# Altium schematic sheet Power_Supply.SchDoc
size A3; SheetNumber: 1; SheetTotal: 1
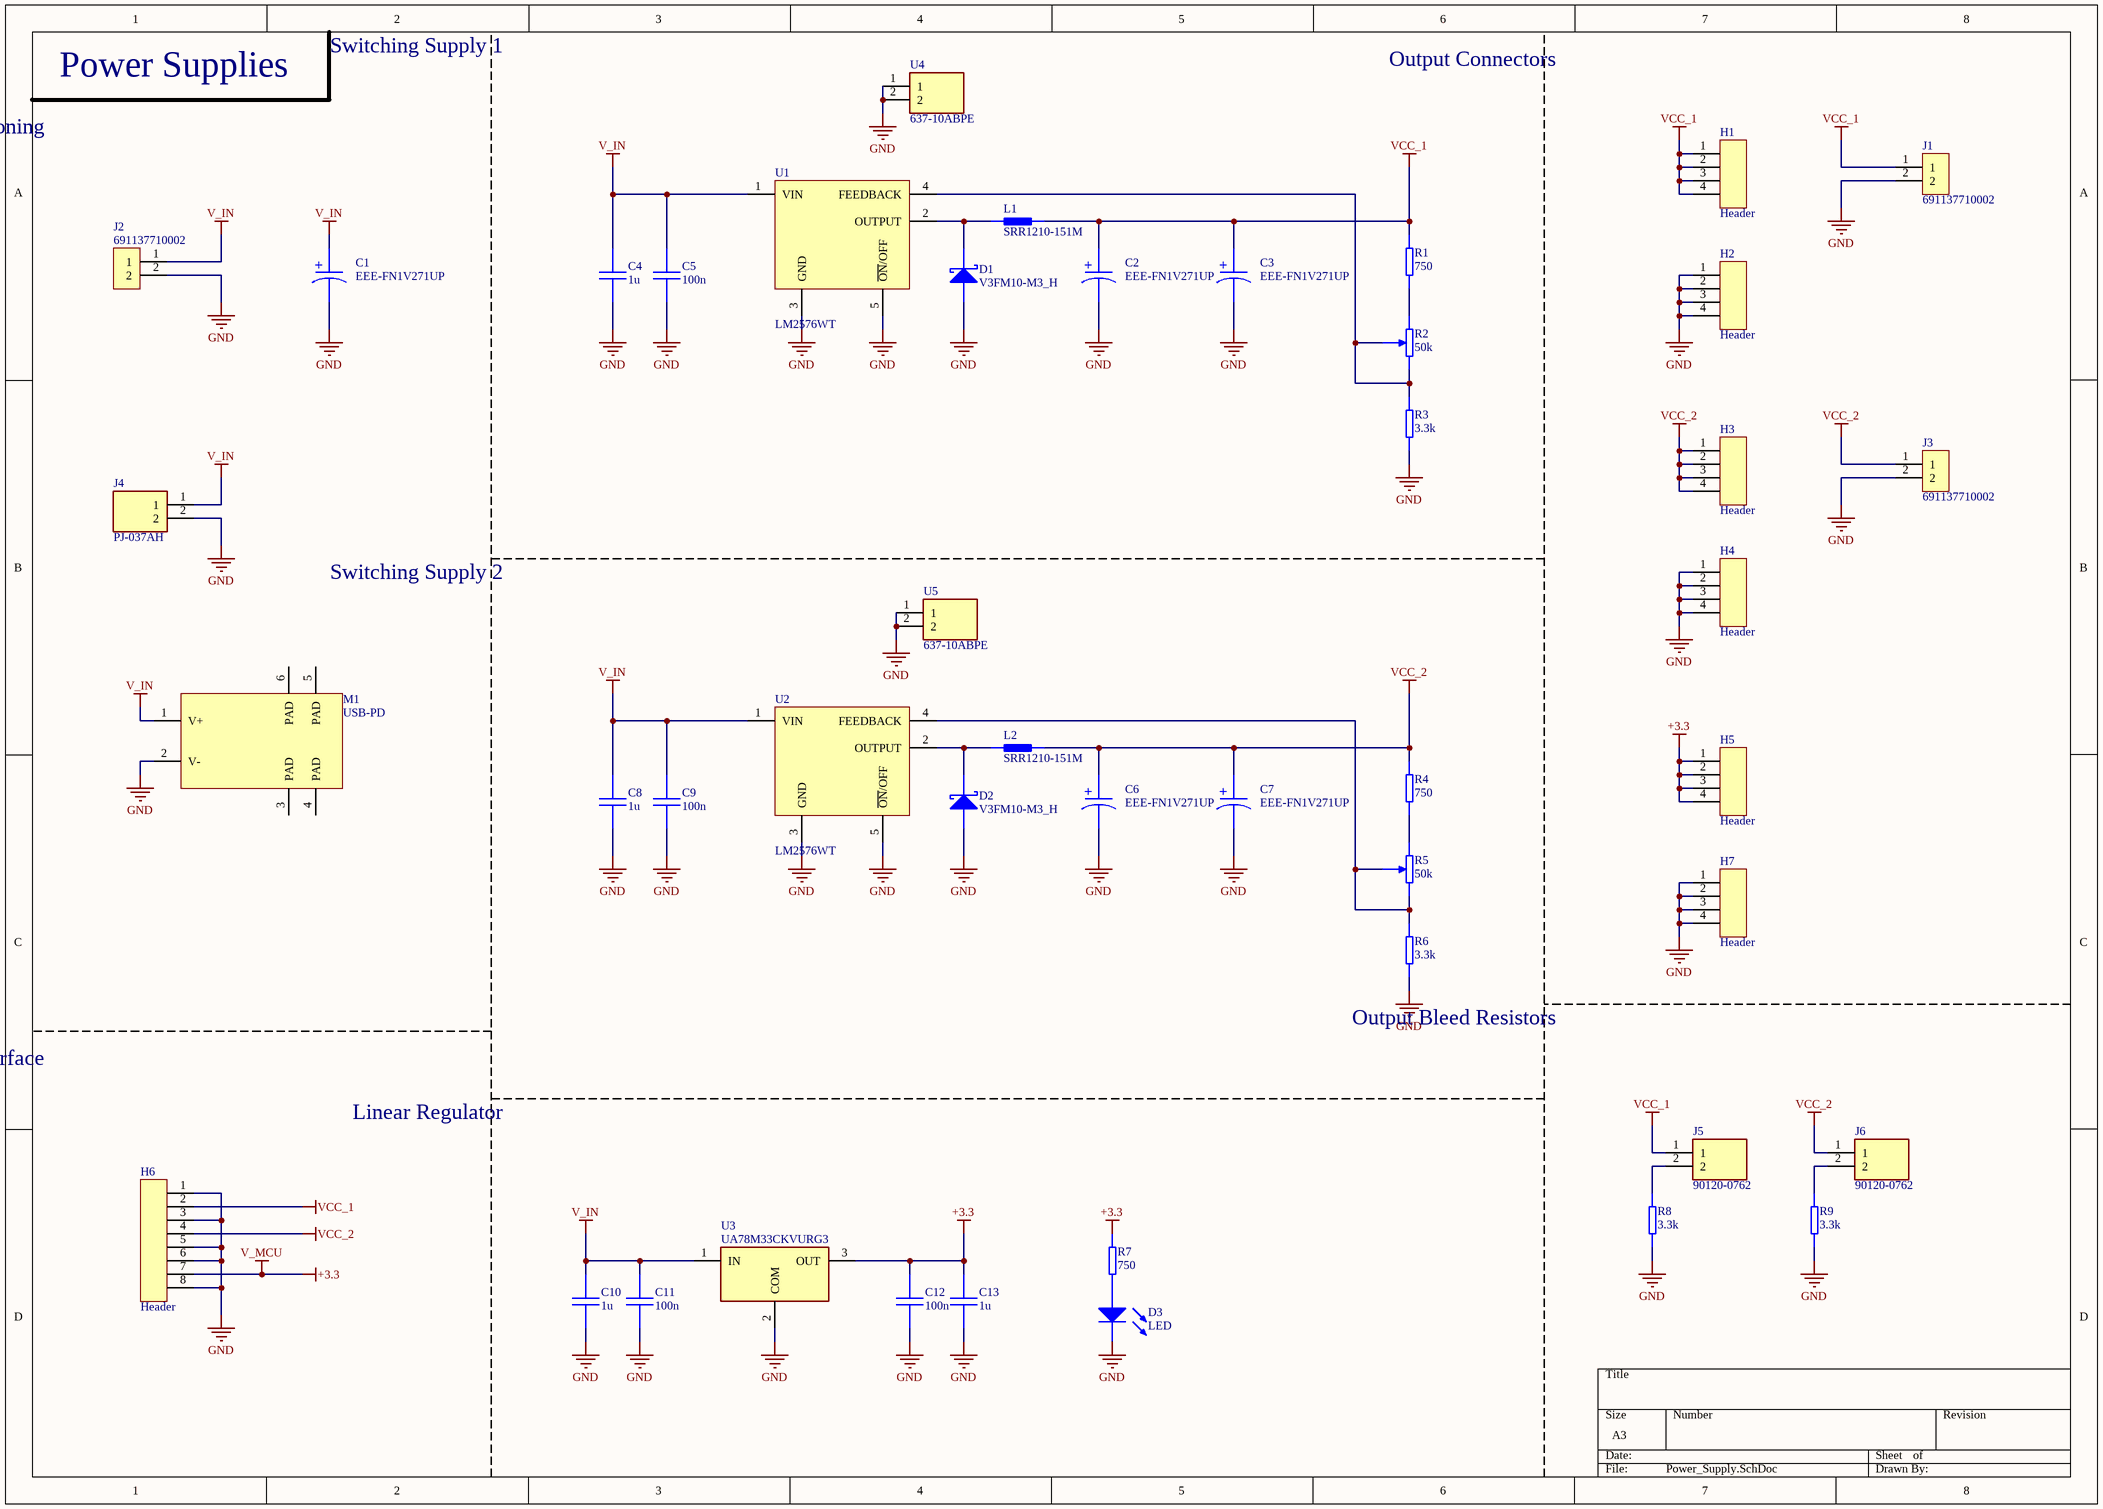
[diagram p0: Power_Supply.SchDoc]

## Parts
C1  EEE-FN1V271UP  [EEHZT1E331UP]
C2  EEE-FN1V271UP  [EEHZT1E331UP]
C3  EEE-FN1V271UP  [EEHZT1E331UP]
C4  1u  [CAP0805]
C5  100n  [CAP0805]
C6  EEE-FN1V271UP  [EEHZT1E331UP]
C7  EEE-FN1V271UP  [EEHZT1E331UP]
C8  1u  [CAP0805]
C9  100n  [CAP0805]
C10  1u  [CAP0805]
C11  100n  [CAP0805]
C12  100n  [CAP0805]
C13  1u  [CAP0805]
D1  V3FM10-M3_H  [DO-219AB]
D2  V3FM10-M3_H  [DO-219AB]
D3  LED  [LEDM2012X80N]
H1  Header  [Header_1X4]
H2  Header  [Header_1X4]
H3  Header  [Header_1X4]
H4  Header  [Header_1X4]
H5  Header  [Header_1X4]
H6  Header  [Header_1X8]
H7  Header  [Header_1X4]
J1  691137710002  [SHDR2W70P0X500_1X2_1000X750X1160P]
J2  691137710002  [SHDR2W70P0X500_1X2_1000X750X1160P]
J3  691137710002  [SHDR2W70P0X500_1X2_1000X750X1160P]
J4  PJ-037AH  [PJ037AH]
J5  90120-0762  [HDRV2W35P0X254_1X2_508X249X560P]
J6  90120-0762  [HDRV2W35P0X254_1X2_508X249X560P]
L1  SRR1210-151M  [INDPM120120X1000N-D]
L2  SRR1210-151M  [INDPM120120X1000N-D]
M1  USB-PD  [USB_C-PD]
R1  750  [RESC0805]
R2  50k  [3339P1103LF]
R3  3.3k  [RESC0805]
R4  750  [RESC0805]
R5  50k  [3339P1103LF]
R6  3.3k  [RESC0805]
R7  750  [RESC0805]
R8  3.3k  [RESC0805]
R9  3.3k  [RESC0805]
U1  LM2576WT  [TO-220-5]
U2  LM2576WT  [TO-220-5]
U3  UA78M33CKVURG3  [TO-252-3]
U4  637-10ABPE  [63710ABPE]
U5  637-10ABPE  [63710ABPE]

## Nets
+3.3: C12.1 C13.1 H5.1 H5.2 H5.3 H5.4 H6.7 R7.1 U3.3(OUT)  [also labelled V_MCU]
GND: C1.2 C2.2 C3.2 C4.2 C5.2 C6.2 C7.2 C8.2 C9.2 C10.2 C11.2 C12.2 C13.2 D1.2(A) D2.2(A) D3.1(K) H2.1 H2.2 H2.3 H2.4 H4.1 H4.2 H4.3 H4.4 H6.1 H6.3 H6.5 H6.6 H6.8 H7.1 H7.2 H7.3 H7.4 J1.2 J2.2 J3.2 J4.2 M1.2(V-) R3.2 R6.2 R8.2 R9.2 U1.3(GND) U1.5(~{ON}/OFF) U2.3(GND) U2.5(~{ON}/OFF) U3.2(COM) U4.1 U4.2 U5.1 U5.2
V_IN: C1.1 C4.1 C5.1 C8.1 C9.1 C10.1 C11.1 J2.1 J4.1 M1.1(V+) U1.1(VIN) U2.1(VIN) U3.1(IN)
VCC_1: C2.1 C3.1 H1.1 H1.2 H1.3 H1.4 H6.2 J1.1 J5.1 L1.2 R1.1
VCC_2: C6.1 C7.1 H3.1 H3.2 H3.3 H3.4 H6.4 J3.1 J6.1 L2.2 R4.1
NetD1_1: D1.1(K) L1.1 U1.2(OUTPUT)
NetD2_1: D2.1(K) L2.1 U2.2(OUTPUT)
NetD3_2: D3.2(A) R7.2
NetJ5_2: J5.2 R8.1
NetJ6_2: J6.2 R9.1
NetR1_2: R1.2 R2.1
NetR2_2: R2.2 R2.3 R3.1 U1.4(FEEDBACK)
NetR4_2: R4.2 R5.1
NetR5_2: R5.2 R5.3 R6.1 U2.4(FEEDBACK)

Not connected (* = marked no-connect by the designer): M1 3(PAD) 4(PAD) 5(PAD) 6(PAD)

## Notes on the sheet
- Power Supplies
- Switching Supply 1
- Output Connectors
- Input Connectors and Conditioning
- Switching Supply 2
- Output Bleed Resistors
- Power Interface
- Linear Regulator
- (in symbol EEE-FN1V271UP) +

## Library data of the parts
C1-C3 C6 C7 = EEE-FN1V271UP: Capacitor Polarised; Manufacturer_Name: Panasonic; Datasheet Link: http://industrial.panasonic.com/cdbs/www-data/pdf/RDE0000/RDE0000C1259.pdf; Height: 10.8mm; Manufacturer_Part_Number: EEE-FN1V271UP; Mouser Part Number: 667-EEE-FN1V271UP; Mouser Price/Stock: https://www.mouser.co.uk/ProductDetail/Panasonic/EEE-FN1V271UP/?qs=OlC7AqGiEDkrGQxqM1X3hg%3D%3D; Arrow Part Number: EEE-FN1V271UP; Arrow Price/Stock: https://www.arrow.com/en/products/eee-fn1v271up/panasonic
C4 C5 C8-C13 = Capacitor - Non Polarized: Non Polarized Capacitor
D1 D2 = V3FM10-M3_H: Schottky Diode; Manufacturer_Name: Vishay; Manufacturer_Part_Number: V3FM10-M3/H; Datasheet Link: https://mouser.componentsearchengine.com/Datasheets/1/V3FM10-M3_H.pdf; Height: 1.08mm; Mouser Part Number: 78-V3FM10-M3/H; Mouser Price/Stock: https://www.mouser.co.uk/ProductDetail/Vishay-General-Semiconductor/V3FM10-M3-H?qs=F5EMLAvA7IChj%2FkhLK3e0A%3D%3D; Arrow Part Number: V3FM10-M3/H; Arrow Price/Stock: https://www.arrow.com/en/products/v3fm10-m3h/vishay
D3 = LED: General Purpose LED; ComponentLink1Description: Datasheet; ComponentLink1URL: https://www.smc-diodes.com/propdf/1N4148W%20N0571%20REV.E.pdf
H1-H5 H7 = 4-Pin Header
H6 = 8-Pin Header: System: Connector
J1-J3 = 691137710002: Connector; Manufacturer_Name: Wurth Elektronik; Datasheet Link: https://katalog.we-online.com/em/datasheet/691137710002.pdf; Height: 11.6mm; Manufacturer_Part_Number: 691137710002; Mouser Part Number: 710-691137710002; Mouser Price/Stock: https://www.mouser.co.uk/ProductDetail/Wurth-Elektronik/691137710002?qs=lBTPRtX1sU9LnHBbviNKGA%3D%3D
J4 = PJ-037AH: Connector; Manufacturer_Name: Same Sky; Datasheet Link: https://www.arrow.com/en/products/pj-037ah/cui-devices; Height: 11.2mm; Manufacturer_Part_Number: PJ-037AH; Mouser Part Number: 490-PJ-037AH; Mouser Price/Stock: https://www.mouser.co.uk/ProductDetail/CUI-Devices/PJ-037AH?qs=WyjlAZoYn50M7m1AkzfPaQ%3D%3D; Arrow Part Number: PJ-037AH; Arrow Price/Stock: https://www.arrow.com/en/products/pj-037ah/cui-devices?region=nac
J5 J6 = 90120-0762: Connector; Manufacturer_Name: Molex; Datasheet Link: http://www.molex.com/pdm_docs/sd/901200762_sd.pdf; Height: 5.6mm; Manufacturer_Part_Number: 90120-0762; Mouser Part Number: 538-90120-0762; Mouser Price/Stock: https://www.mouser.co.uk/ProductDetail/Molex/90120-0762?qs=NKHyz0HolODkarWFh2VFww%3D%3D; Arrow Part Number: 90120-0762; Arrow Price/Stock: https://www.arrow.com/en/products/90120-0762/molex?region=nac
L1 L2 = SRR1210-151M: Inductor; Manufacturer_Name: Bourns; Datasheet Link: https://www.bourns.com/docs/Product-Datasheets/SRR1210.pdf; Height: 10mm; Manufacturer_Part_Number: SRR1210-151M; Mouser Part Number: 652-SRR1210-151M; Mouser Price/Stock: https://www.mouser.co.uk/ProductDetail/Bourns/SRR1210-151M?qs=4vvWAaIu%2Fq7S1x5W5meWRQ%3D%3D; Arrow Part Number: SRR1210-151M; Arrow Price/Stock: https://www.arrow.com/en/products/srr1210-151m/bourns?region=nac
R1 R3 R4 R6-R9 = Resistor
R2 R5 = Potentiometer: Potentionmeter
U1 U2 = LM2576WT: Integrated Circuit; Manufacturer_Name: Microchip; Manufacturer_Part_Number: LM2576WU-TR; Datasheet Link: http://ww1.microchip.com/downloads/en/DeviceDoc/lm2576.pdf; Mouser Part Number: 998-LM2576WT; Mouser Price/Stock: https://www.mouser.co.uk/ProductDetail/Microchip-Technology/LM2576-5.0WU-TR?qs=Y3Q3JoKAO1SBuj%2FVzZkeQA%3D%3D; Arrow Part Number: LM2576-5.0WU-TR; Arrow Price/Stock: https://www.arrow.com/en/products/lm2576-5.0wu-tr/microchip-technology?region=nac
U3 = UA78M33CKVURG3: Linear Voltage Regulator; Manufacturer_Name: Texas Instruments; Datasheet Link: https://www.ti.com/lit/gpn/ua78m?HQS=ti-null-null-sf-df-pf-sep-wwe&DCM=yes; Height: 2.52mm; Manufacturer_Part_Number: UA78M33CKVURG3; Mouser Part Number: 595-UA78M33CKVURG3; Mouser Price/Stock: https://www.mouser.co.uk/ProductDetail/Texas-Instruments/UA78M33CKVURG3?qs=0O%2FZFlpUpJXrDg4gfD1Q2g%3D%3D; Arrow Part Number: UA78M33CKVURG3; Arrow Price/Stock: https://www.arrow.com/en/products/ua78m33ckvurg3/texas-instruments?region=nac
U4 U5 = 637-10ABPE: Undefined or Miscellaneous; Manufacturer_Name: Wakefield Thermal; Datasheet Link: https://media.digikey.com/pdf/Data%20Sheets/Wakefield%20Thermal%20PDFs/634%20Heat%20Sinks.pdf; Height: 25.4mm; Manufacturer_Part_Number: 637-10ABPE; Mouser Part Number: 567-637-10ABPE; Mouser Price/Stock: https://www.mouser.co.uk/ProductDetail/Wakefield-Vette/637-10ABPE?qs=1%252ByrAFyf4wFy1bU0h8s7wA%3D%3D